# EAGLE schematic cw-twostage-standard (EAGLE 9.4.1)
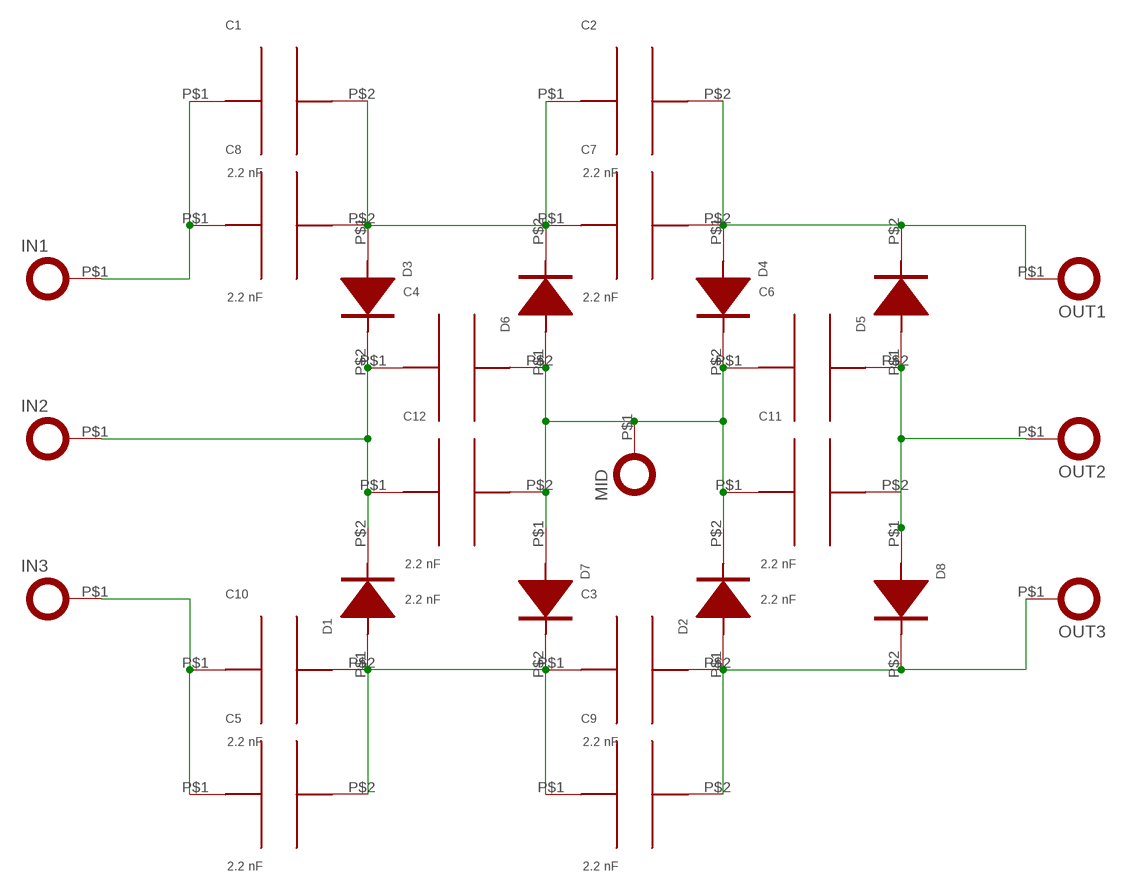
[diagram p0: schematic, sheet 1]

## Parts
C1  2.2 nF  HV_CAPACITOR_12MM  [CAP_CT81_12]
C2  2.2 nF  HV_CAPACITOR_12MM  [CAP_CT81_12]
C3  2.2 nF  HV_CAPACITOR_12MM  [CAP_CT81_12]
C4  2.2 nF  HV_CAPACITOR_12MM  [CAP_CT81_12]
C5  2.2 nF  HV_CAPACITOR_12MM  [CAP_CT81_12]
C6  2.2 nF  HV_CAPACITOR_12MM  [CAP_CT81_12]
C7  2.2 nF  HV_CAPACITOR_12MM  [CAP_CT81_12]
C8  2.2 nF  HV_CAPACITOR_12MM  [CAP_CT81_12]
C9  2.2 nF  HV_CAPACITOR_12MM  [CAP_CT81_12]
C10  2.2 nF  HV_CAPACITOR_12MM  [CAP_CT81_12]
C11  2.2 nF  HV_CAPACITOR_12MM  [CAP_CT81_12]
C12  2.2 nF  HV_CAPACITOR_12MM  [CAP_CT81_12]
D1  DIODE_14MM  [DIODE_14]
D2  DIODE_14MM  [DIODE_14]
D3  DIODE_14MM  [DIODE_14]
D4  DIODE_14MM  [DIODE_14]
D5  DIODE_14MM  [DIODE_14]
D6  DIODE_14MM  [DIODE_14]
D7  DIODE_14MM  [DIODE_14]
D8  DIODE_14MM  [DIODE_14]
IN1  TERMINAL_M6  [LUG_SQUARE_M6]
IN2  TERMINAL_M6  [LUG_SQUARE_M6]
IN3  TERMINAL_M6  [LUG_SQUARE_M6]
MID  TERMINAL_M6  [LUG_SQUARE_M6]
OUT1  TERMINAL_M6  [LUG_SQUARE_M6]
OUT2  TERMINAL_M6  [LUG_SQUARE_M6]
OUT3  TERMINAL_M6  [LUG_SQUARE_M6]

## Nets
N$1: C5.P$1 C10.P$1 IN3.P$1
N$3: C4.P$2 C6.P$1 C11.P$1 C12.P$2 D2.P$2(CATHODE) D4.P$2(CATHODE) D6.P$1(ANODE) D7.P$1(ANODE) MID.P$1
N$4: C1.P$1 C8.P$1 IN1.P$1
N$5: C6.P$2 C11.P$2 D5.P$1(ANODE) D8.P$1(ANODE) OUT2.P$1
N$6: C3.P$1 C5.P$2 C9.P$1 C10.P$2 D1.P$1(ANODE) D7.P$2(CATHODE)
N$7: C1.P$2 C2.P$1 C7.P$1 C8.P$2 D3.P$1(ANODE) D6.P$2(CATHODE)
N$8: C3.P$2 C9.P$2 D2.P$1(ANODE) D8.P$2(CATHODE) OUT3.P$1
N$10: C4.P$1 C12.P$1 D1.P$2(CATHODE) D3.P$2(CATHODE) IN2.P$1
N$11: C2.P$2 C7.P$2 D4.P$1(ANODE) D5.P$2(CATHODE) OUT1.P$1

## Library data of the parts
C1-C12 = cwParts:HV_CAPACITOR_12MM: High Voltage Ceramic Capacitor with 12mm pitch.
D1-D8 = cwParts:DIODE_14MM: Generic diode with 14mm footprint.
IN1-IN3 MID OUT1-OUT3 = cwParts:TERMINAL_M6: Attachment for an M6 terminal